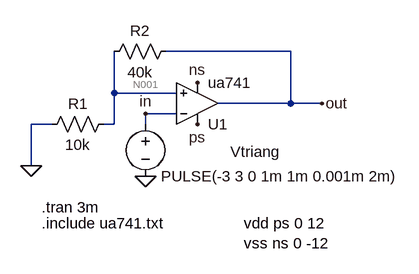
[diagram p0: schematic opamp_bistable.asc]
opamp_bistable.asc, the LTspice schematic file:
Version 4
SHEET 1 880 680
WIRE 368 64 176 64
WIRE 96 128 96 64
WIRE 192 128 96 128
WIRE 368 144 368 64
WIRE 368 144 256 144
WIRE 416 144 368 144
WIRE 192 160 144 160
WIRE 0 176 -32 176
WIRE 96 176 96 128
WIRE 96 176 80 176
WIRE 144 176 144 160
WIRE -32 240 -32 176
FLAG -32 240 0
FLAG 144 256 0
FLAG 224 176 ps
FLAG 224 112 ns
FLAG 416 144 out
FLAG 144 160 in
SYMBOL OpAmps\\opamp2 224 208 M180
SYMATTR InstName U1
SYMATTR Value ua741
SYMBOL res 96 160 R90
WINDOW 0 0 56 VBottom 2
WINDOW 3 32 56 VTop 2
SYMATTR InstName R1
SYMATTR Value 10k
SYMBOL res 192 48 R90
WINDOW 0 0 56 VBottom 2
WINDOW 3 32 56 VTop 2
SYMATTR InstName R2
SYMATTR Value 40k
SYMBOL voltage 144 160 R0
WINDOW 0 131 58 Left 2
WINDOW 123 0 0 Left 0
WINDOW 39 0 0 Left 0
SYMATTR InstName Vtriang
SYMATTR Value PULSE(-3 3 0 1m 1m 0.001m 2m)
TEXT 296 328 Left 2 !vdd ps 0 12\nvss ns 0 -12
TEXT -16 304 Left 2 !.tran 3m
TEXT -16 328 Left 2 !.include ua741.txt

The netlist it stands for:
* opamp_bistable.asc
XU1 N001 in ps ns out ua741  ; pins In+ In- V+ V- OUT
R1 N001 0 10k
R2 out N001 40k
Vtriang in 0 PULSE(-3 3 0 1m 1m 0.001m 2m)
vdd ps 0 12
vss ns 0 -12
.tran 3m
.include ua741.txt
.backanno
.end

* Results of the author's LTspice run, read from the files saved beside the schematic
* Operating Point, zero values left out:
*   V(out) = 10.01 V
*   V(ns) = -12 V
*   V(ps) = 12 V
*   V(in) = -3 V
*   V(n001) = 2 V
*   I(R2) = 200.1 µA
*   I(R1) = 200 µA
*   I(Vss) = 1.335 mA
*   I(Vdd) = -1.324 mA
*   I(Vtriang) = 19.37 pA
*   Ix(u1:1) = 161.1 nA
*   Ix(u1:2) = -19.37 pA
*   Ix(u1:3) = 1.324 mA
*   Ix(u1:4) = -1.335 mA
*   Ix(u1:5) = -200.1 µA
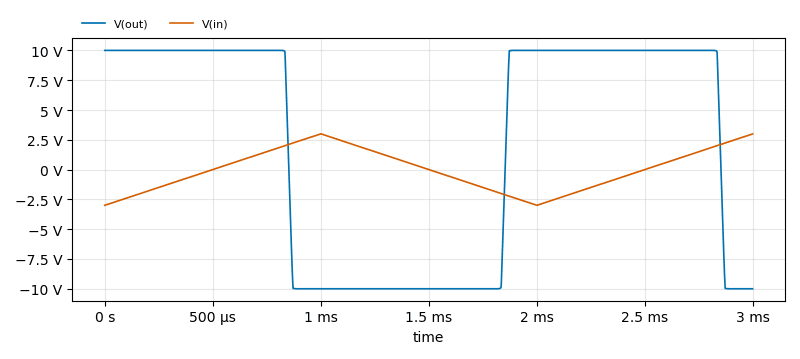
[diagram p1: Transient Analysis of opamp_bistable.asc, plotted from the saved traces]
* Transient Analysis, 1 run:
*   V(out): min -10.01 V, max 10.01 V, average 2.35 V, rms 9.929 V, last -10.01 V
*   V(in): min -3 V, max 2.999 V, average -53.93 µV, rms 2.312 V, last 2.994 V